# EAGLE schematic 8-MC_v01 (EAGLE 9.7.0)
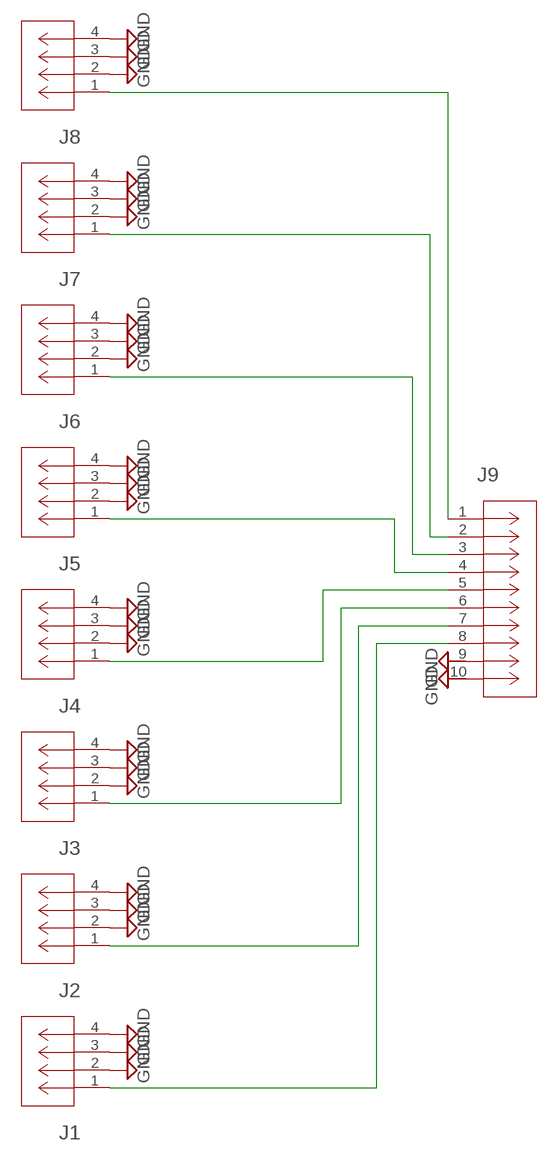
[diagram p0: schematic, sheet 1]

## Parts
J1  5055670281CON_5055670281  [CON_5055670281]
J2  5055670281CON_5055670281  [CON_5055670281]
J3  5055670281CON_5055670281  [CON_5055670281]
J4  5055670281CON_5055670281  [CON_5055670281]
J5  5055670281CON_5055670281  [CON_5055670281]
J6  5055670281CON_5055670281  [CON_5055670281]
J7  5055670281CON_5055670281  [CON_5055670281]
J8  5055670281CON_5055670281  [CON_5055670281]
J9  FH52-10S-0.5SHCONN10_FH52-10S-0.5SH_HIR  [CONN10_FH52-10S-0.5SH_HIR]

## Nets
GND: J1.2 J1.3 J1.4 J2.2 J2.3 J2.4 J3.2 J3.3 J3.4 J4.2 J4.3 J4.4 J5.2 J5.3 J5.4 J6.2 J6.3 J6.4 J7.2 J7.3 J7.4 J8.2 J8.3 J8.4
N$1: J8.1 J9.1
N$2: J7.1 J9.2
N$3: J6.1 J9.3
N$4: J5.1 J9.4
N$5: J1.1 J9.8
N$6: J2.1 J9.7
N$7: J3.1 J9.6
N$8: J4.1 J9.5
Unconnected: J9.9 J9.10

## Library data of the parts
J1-J8 = 2021-08-12_20-40-52_Library:5055670281; COPYRIGHT: Copyright (C) 2021 Ultra Librarian. All rights reserved.; MANUFACTURER_PART_NUMBER: 5055670281; MFR_NAME: Molex Connector Corporation
J9 = 2021-08-09_13-11-40_Library:FH52-10S-0.5SH; COPYRIGHT: Copyright (C) 2021 Ultra Librarian. All rights reserved.; DIGI-KEY_PART_NUMBER_1: H126109TR-ND; DIGI-KEY_PART_NUMBER_2: H126109CT-ND; DIGI-KEY_PART_NUMBER_3: H126109DKR-ND; MANUFACTURER_PART_NUMBER: FH52-10S-0.5SH; MFR_NAME: Hirose